# EAGLE design rapidshark-display-shifter-mk-3.2 (EAGLE 6.5.0)
AUTHOR: sean@yak.net
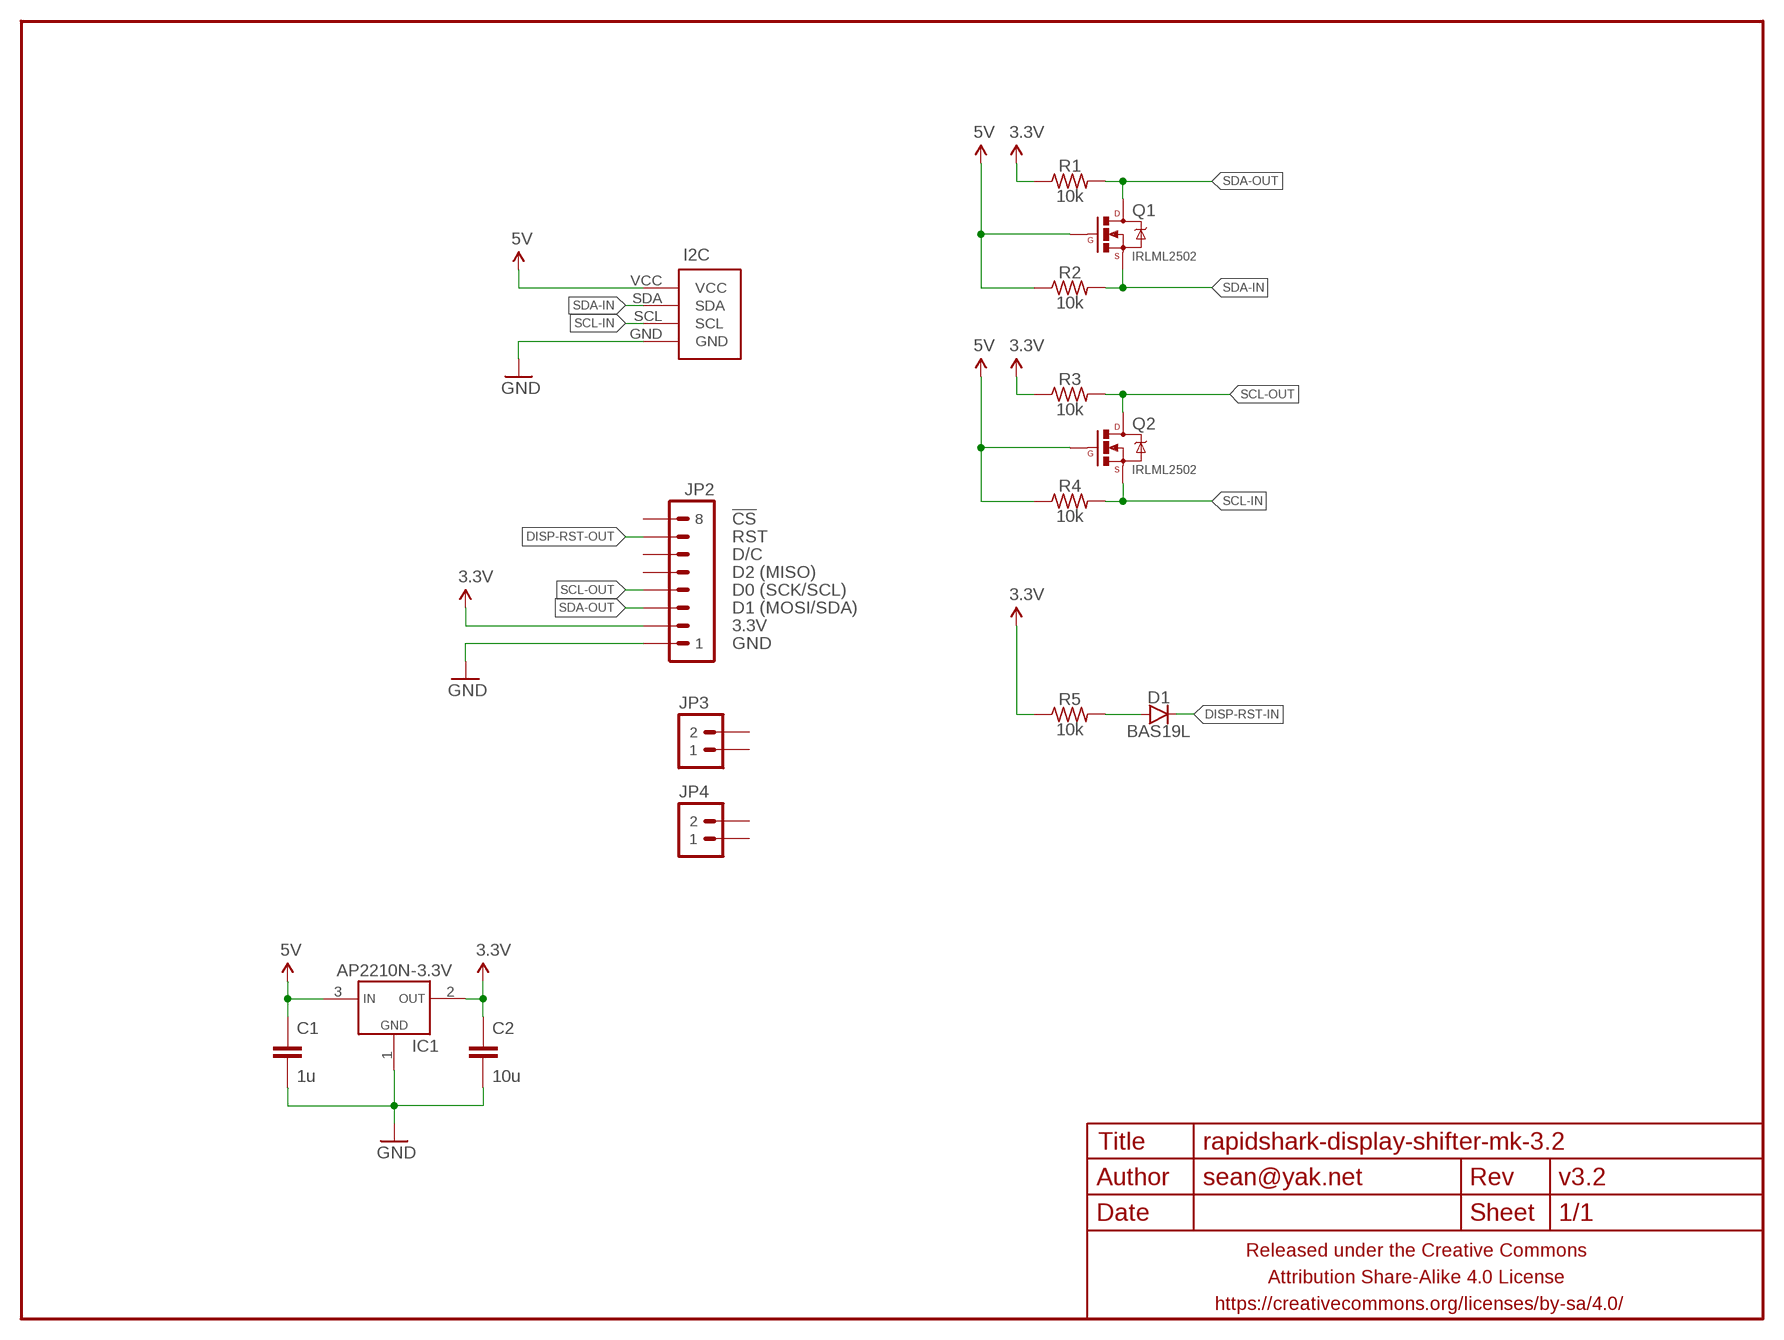
[diagram p0: schematic, sheet 1]

## Parts
C1  1u  CAPACITOR-CERAMICC0805  [C0805]
C2  10u  CAPACITOR-CERAMICC0805  [C0805]
D1  BAS19L  DIODESOT23  [SOT23]
FRAME1  FRAME-LETTERNO_PACKAGE  [DUMMY]
I2C  M04-I2CPTH-0.1IN-CENTERED-FLIPPED  [1X04-PTH-VERT-I2C-CENTERED-FLIPPED]
IC1  AP2210N-3.3V  VREG_1117SOT-23  [SOT23]
JP2  M081X08  [1X08]
JP3  M021X02_NO_SILK  [1X02_NO_SILK]
JP4  M021X02_NO_SILK  [1X02_NO_SILK]
Q1  IRLML2502  MOSFET-NCHANNELIRLML2502  [SOT23]
Q2  IRLML2502  MOSFET-NCHANNELIRLML2502  [SOT23]
R1  10k  RESISTORR0603  [R0603]
R2  10k  RESISTORR0603  [R0603]
R3  10k  RESISTORR0603  [R0603]
R4  10k  RESISTORR0603  [R0603]
R5  10k  RESISTORR0603  [R0603]

## Nets
3.3V: C2.1 IC1.2(VOUT) JP2.2 R1.1 R3.1 R5.1
5V: C1.1 I2C.VCC IC1.3(VIN) Q1.1(G) Q2.1(G) R2.1 R4.1
DISP-RST-IN: D1.3(C)
DISP-RST-OUT: JP2.7
GND: C1.2 C2.2 I2C.GND IC1.1(GND) JP2.1
N$1: D1.1(A) R5.2
SCL-IN: I2C.SCL Q2.2(S) R4.2
SCL-OUT: JP2.4 Q2.3(D) R3.2
SDA-IN: I2C.SDA Q1.2(S) R2.2
SDA-OUT: JP2.3 Q1.3(D) R1.2
Unconnected: JP2.5 JP2.6 JP2.8 JP3.1 JP3.2 JP4.1 JP4.2

## Notes on the sheet
- !CS
- RST
- D/C
- D2 (MISO)
- D0 (SCK/SCL)
- D1 (MOSI/SDA)
- 3.3V
- GND

## Library data of the parts
C1 C2 = A_butts:CAPACITOR-CERAMIC: CAPACITOR, European symbol
D1 = A_butts:DIODE: Diode These are standard reverse protection diodes and small signal diodes. SMA package can handle up to about 1A. SOD-323 can handle about 200mA. What the SOD-323 package when ordering, there are some mfgs out there that are 5-pin packages.
FRAME1 = A_butts:FRAME-LETTER: Schematic Frame Standard 8.5x11 US Letter frame; DESIGNER: sean@yak.net; VERSION: v3.2
I2C = a_parts:M04-I2C
IC1 = A_butts:VREG_1117
JP2 = A_butts:M08: Header 8 Standard 8-pin 0.1" header. Use with straight break away headers (SKU : PRT-00116), right angle break away headers (PRT-00553), swiss pins (PRT-00743), machine pins (PRT-00117), and female headers (PRT-00115).
JP3 JP4 = a_parts:M02: Standard 2-pin 0.1" header. Use with - straight break away headers ( PRT-00116) - right angle break away headers (PRT-00553) - swiss pins (PRT-00743) - machine pins (PRT-00117) - female headers (PRT-00115) Molex polarized connector foot print use with: PRT-08233 with associated crimp pins and housings. 2.54_SCREWTERM for use with PRT-10571. 3.5mm Screw Terminal footprints for PRT-08084 5mm Screw Terminal footprints for use with PRT-08433
Q1 Q2 = A_butts:MOSFET-NCHANNEL: Common NMOSFET Parts MFG P/N Store ID Prod ID FDD8780 TRANS-09984 SI7820DN TRANS-11055 FDS6630A IC-08089 2N7002PW TRANS-11151 FQP30N06L COM-10213 TRANS-10060 BSS123LT1G TRANS-08345 BSS138 TRANS-00830 BS170 2N7000
R1-R5 = A_butts:RESISTOR: RESISTOR, American symbol

## Board
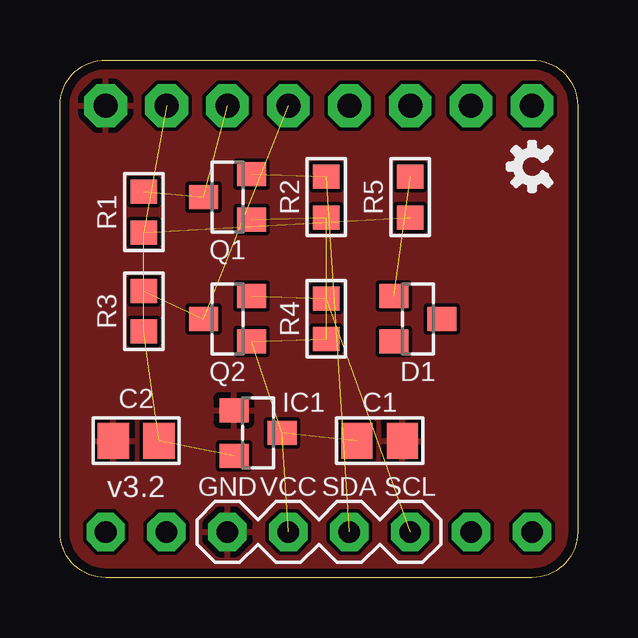
[diagram p1: board, top side]
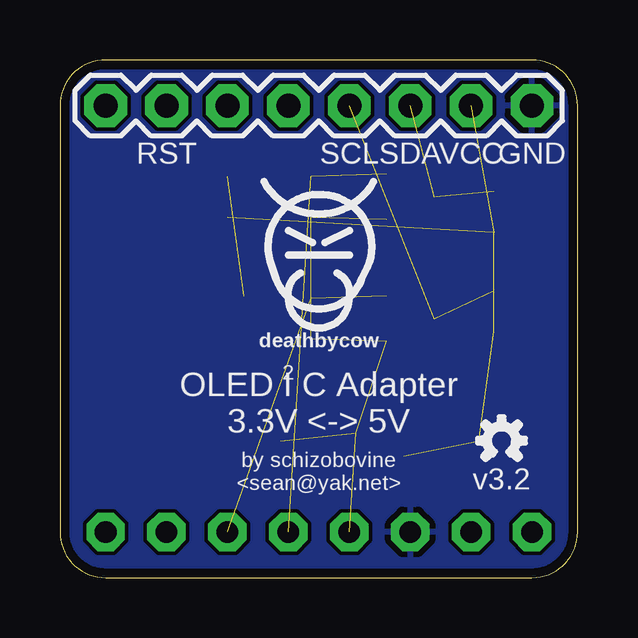
[diagram p2: board, bottom side, seen from below]

Size 21.59 x 21.59 mm. Coordinates in mm from the lower left corner, seen from the top.
Outline: 19.69,0 1.91,0 arc-90 0,1.91 0,19.69 arc-90 1.91,21.59 19.69,21.59 arc-90 21.59,19.69 21.59,1.91 arc-90 19.69,0
Copper layers (1*16): Top 0.0356mm / dielectric 1.5011mm / Bottom 0.0356mm
Design rules "LaenPCBOrder_2": minimum track width 6mil, minimum drill 13mil, track to track 6mil, track to pad 6mil, pad to pad 6mil, via to via 6mil, smd to smd 6mil, copper to edge 15mil, drill to drill 6mil, minimum pad ring 7mil, minimum via ring 7mil, stop-mask expansion 3mil, vias tented up to drill 20mil, thermal gap 10mil

### Footprints (pad centres in the part's own frame; a part is rotated, then mirrored left to right if it is on the bottom)
C0805 = smd 1.3 x 1.5: 1 -0.95,0; 2 0.95,0
SOT23 = smd 1 x 1.2: 1 -0.95,-1; 2 0.95,-1; 3 0,1
1X04-PTH-VERT-I2C-CENTERED-FLIPPED = drill 0.9 pad 1.6 octagon: GND 3.81,0; SCL -3.81,0; SDA -1.27,0; VCC 1.27,0
1X08 = drill 1 pad 1.778 octagon: 1 0,0; 2 2.54,0; 3 5.08,0; 4 7.62,0; 5 10.16,0; 6 12.7,0; 7 15.24,0; 8 17.78,0
1X02_NO_SILK = drill 0.9 pad 1.6 octagon: 1 0,0; 2 2.54,0
R0603 = smd 1 x 1.1: 1 -0.85,0; 2 0.85,0

### Placement (x,y rotation side)
C1  13.33,5.71 0 top
C2  3.17,5.71 180 top
D1  14.92,10.79 270 top
FRAME1  0.64,0.64 270 bottom
I2C  10.79,1.91 180 top
IC1  8.26,6.03 270 top
JP2  1.91,19.69 180 bottom
JP3  1.91,1.91 0 top
JP4  19.69,1.91 180 top
Q1  6.98,15.88 90 top
Q2  6.98,10.79 90 top
R1  3.49,15.24 90 top
R2  11.11,15.88 90 top
R3  3.49,11.11 90 top
R4  11.11,10.79 90 top
R5  14.61,15.88 90 top
U$1  [COW_SMALL]  10.79,13.97 0 bottom
U$2  [OSHWLOGO_TINY_SILKONLY]  19.69,17.15 90 top
U$3  [OSHWLOGO_TINY_SILKONLY]  3.17,5.71 0 bottom

### Tracks (layer width: path | path; a pad name or v marks a point on that pad's centre or on a via)
3.3V  (5 unrouted)
5V  (6 unrouted)
GND
  pour Top (rank 6): 19.69,0 1.91,0 arc-90 0,1.91 0,19.69 arc-90 1.91,21.59 19.69,21.59 arc-90 21.59,19.69 21.59,1.91 arc-90
  pour Bottom (rank 6): 19.69,0 1.91,0 arc-90 0,1.91 0,19.69 arc-90 1.91,21.59 19.69,21.59 arc-90 21.59,19.69 21.59,1.91 arc-90
N$1  (1 unrouted)
SCL-IN  (2 unrouted)
SCL-OUT  (2 unrouted)
SDA-IN  (2 unrouted)
SDA-OUT  (2 unrouted)

### Text on the board
bPlace: GND | VCC | SDA | SCL | RST | 2 | OLED I C Adapter / 3.3V <-> 5V | by schizobovine / <sean@yak.net>